# Altium schematic sheet main.SchDoc: =DocumentName
size A3; Scale: 1:1; DocumentType: Схема электрическая принципиальная; FirstReferrence: АБВГ.123456.001; CompanyName: "AS Manufacturing" LLC; Organization: "AS Manufacturing" LLC; Address1: 5 Sklyarenka St.; Address2: Kyiv 04073; Address3: Ukraine; Address4: https://ajax.systems/en/; SheetNumber: 1; SheetTotal: 8; Template_version: 1.0.1
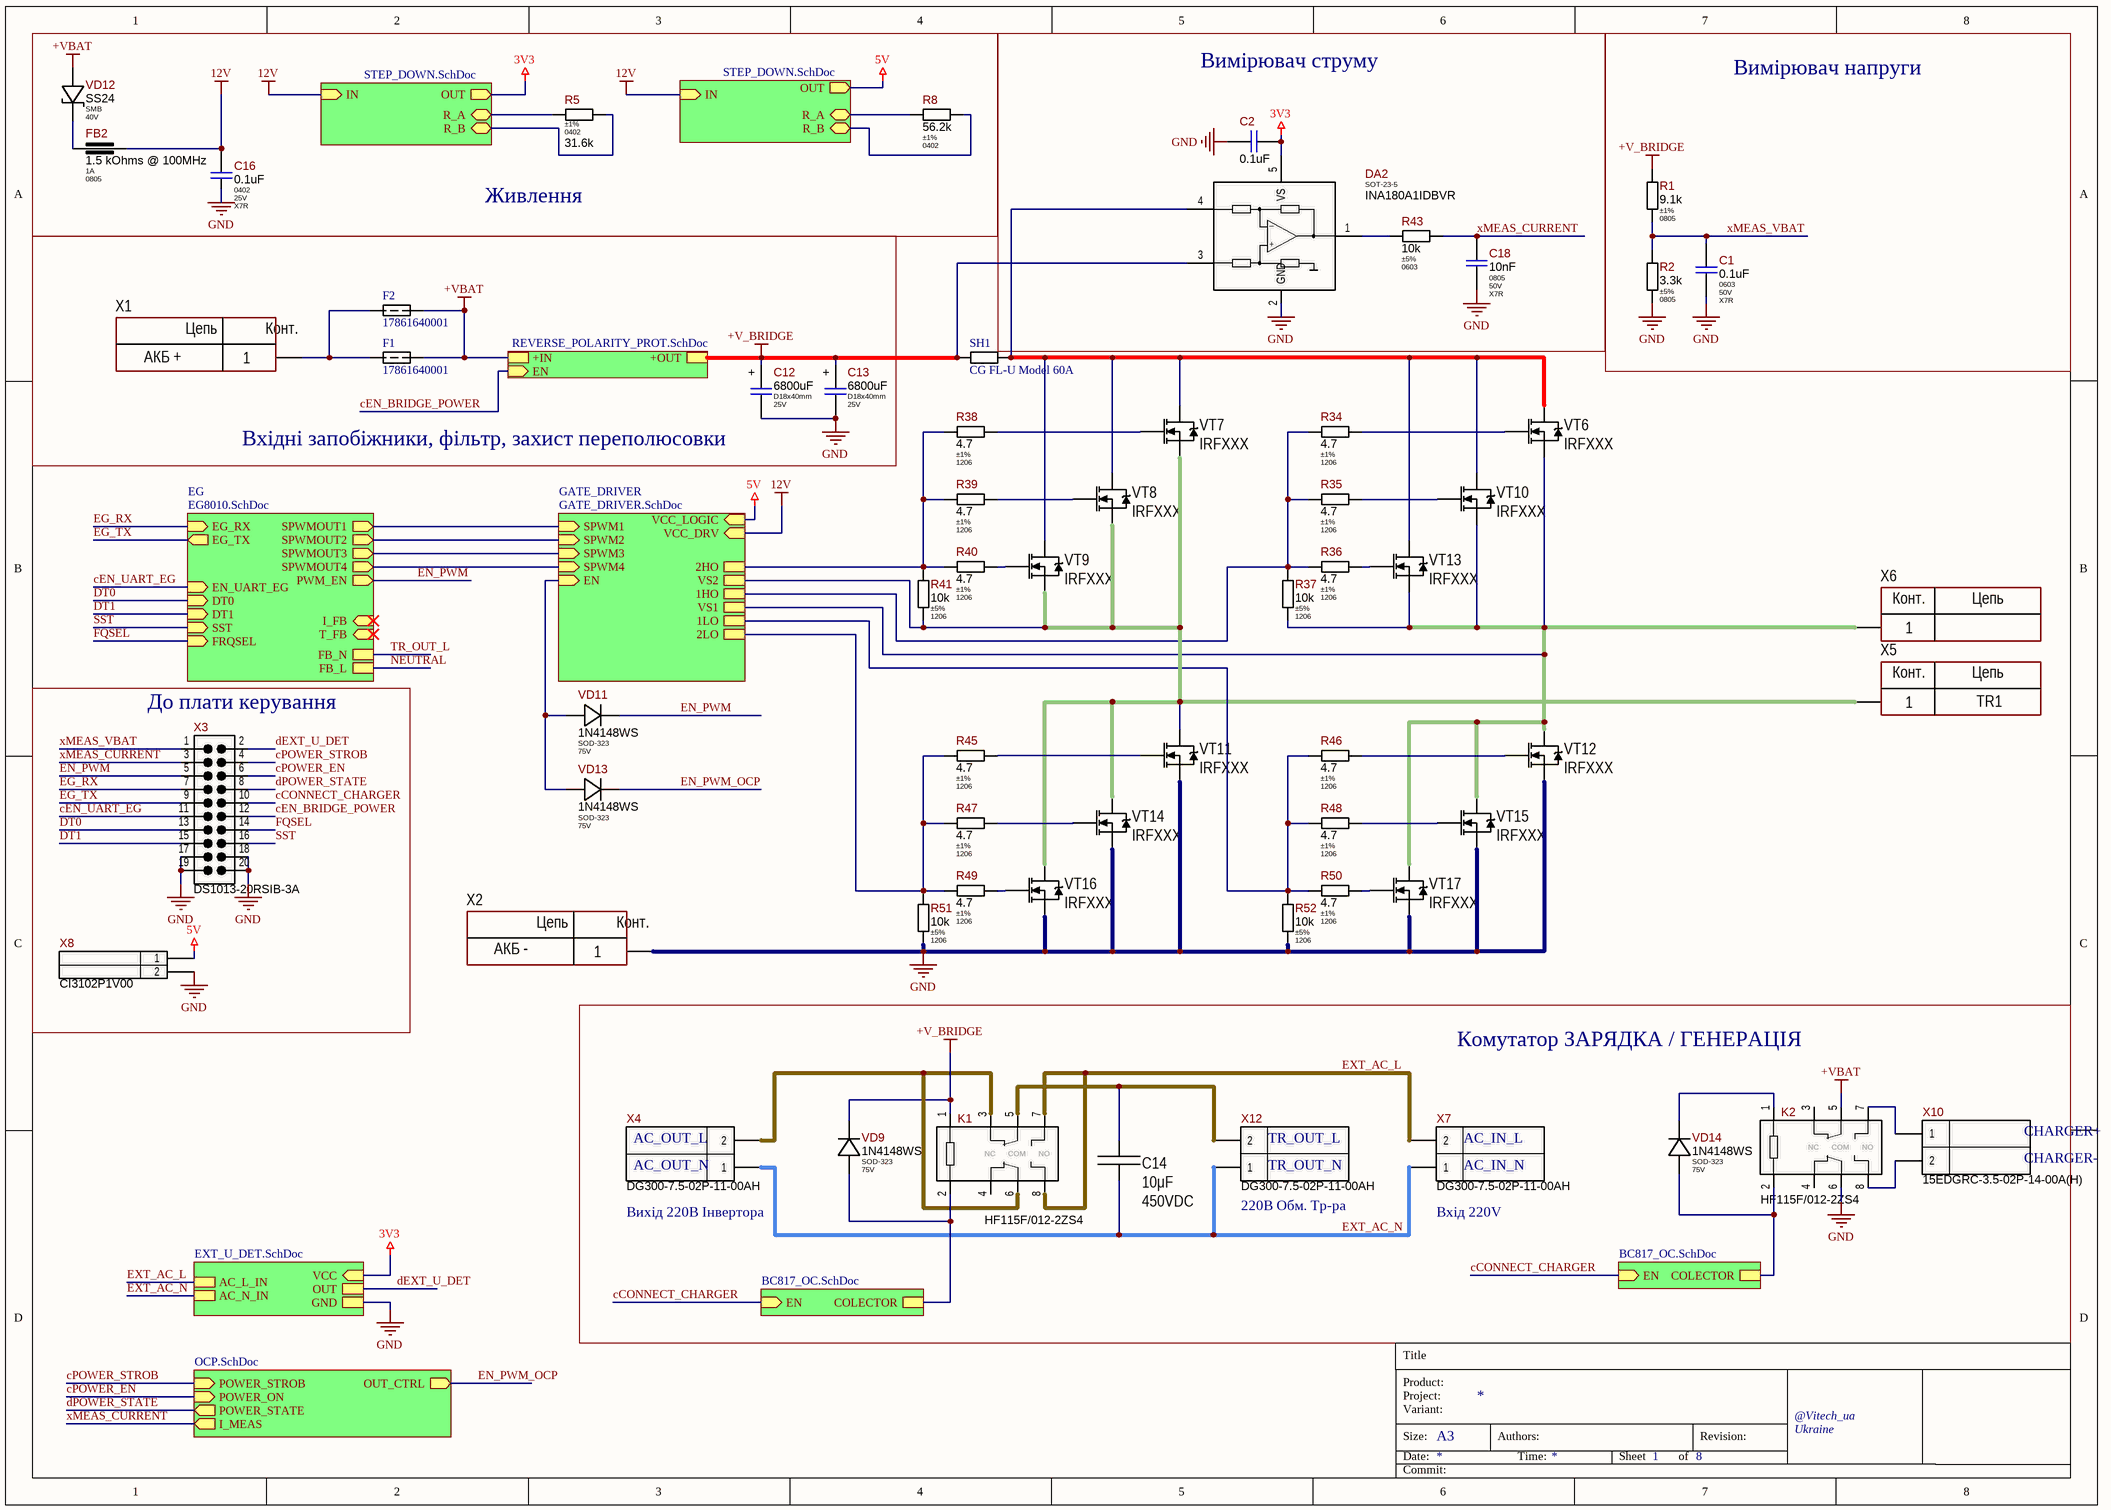
[diagram p0: main.SchDoc]

## Parts
C1  Package: 0603  Voltage: 50V  Dielectric Type: X7R  [C_CERAMIC_0603_MED]  (hidden comment: 0.1uF)
C2  0.1uF  [C_CERAMIC_0402_MED]
C12  value 6800uF  Package: D18x40mm  Voltage: 25V  [CAP-AE-PTH-180D05x400H20]  (hidden comment: 6800uFx25V)
C13  value 6800uF  Package: D18x40mm  Voltage: 25V  [CAP-AE-PTH-180D05x400H20]  (hidden comment: 6800uFx25V)
C14  value 10μF  Voltage: 450VDC  [CAP: B32922 (18x7x12.5mm)]
C16  Package: 0402  Voltage: 25V  Dielectric Type: X7R  [C_CERAMIC_0402_MED]  (hidden comment: 0.1uF)
C18  Package: 0805  Voltage: 50V  Dielectric Type: X7R  [CAP-0805(2012)X65T10]  (hidden comment: 10nF)
DA2  INA180A1IDBVR  [SOT-23-5]
F1  17861640001  [17861640001]
F2  17861640001  [17861640001]
FB2  value 1.5 kOhms @ 100MHz  Current: 1A  Package: 0805  [WE-CBF-0805-Series]  (hidden comment: 742792097)
K1  HF115F/012-2ZS4  [HF115Fxxx-1(2)Zx3(4)]
K2  HF115F/012-2ZS4  [HF115Fxxx-1(2)Zx3(4)]
R1  Tolerance: ±1%  Package: 0805  [R_ANY_CHIP_0805_MED]  (hidden comment: 9.1k)
R2  Tolerance: ±5%  Package: 0805  [R_ANY_CHIP_0805_MED]  (hidden comment: 3.3k)
R5  Tolerance: ±1%  Package: 0402  [R_ANY_CHIP_0402_MED]  (hidden comment: 31.6k)
R8  Tolerance: ±1%  Package: 0402  [R_ANY_CHIP_0402_MED]  (hidden comment: 56.2k)
R34  Tolerance: ±1%  Package: 1206  [R_ANY_CHIP_1206_MED]  (hidden comment: 4.7)
R35  Tolerance: ±1%  Package: 1206  [R_ANY_CHIP_1206_MED]  (hidden comment: 4.7)
R36  Tolerance: ±1%  Package: 1206  [R_ANY_CHIP_1206_MED]  (hidden comment: 4.7)
R37  Tolerance: ±5%  Package: 1206  [R_ANY_CHIP_1206_MED]  (hidden comment: 10k)
R38  Tolerance: ±1%  Package: 1206  [R_ANY_CHIP_1206_MED]  (hidden comment: 4.7)
R39  Tolerance: ±1%  Package: 1206  [R_ANY_CHIP_1206_MED]  (hidden comment: 4.7)
R40  Tolerance: ±1%  Package: 1206  [R_ANY_CHIP_1206_MED]  (hidden comment: 4.7)
R41  Tolerance: ±5%  Package: 1206  [R_ANY_CHIP_1206_MED]  (hidden comment: 10k)
R43  Tolerance: ±5%  Package: 0603  [R_ANY_CHIP_0603_MED]  (hidden comment: 10k)
R45  Tolerance: ±1%  Package: 1206  [R_ANY_CHIP_1206_MED]  (hidden comment: 4.7)
R46  Tolerance: ±1%  Package: 1206  [R_ANY_CHIP_1206_MED]  (hidden comment: 4.7)
R47  Tolerance: ±1%  Package: 1206  [R_ANY_CHIP_1206_MED]  (hidden comment: 4.7)
R48  Tolerance: ±1%  Package: 1206  [R_ANY_CHIP_1206_MED]  (hidden comment: 4.7)
R49  Tolerance: ±1%  Package: 1206  [R_ANY_CHIP_1206_MED]  (hidden comment: 4.7)
R50  Tolerance: ±1%  Package: 1206  [R_ANY_CHIP_1206_MED]  (hidden comment: 4.7)
R51  Tolerance: ±5%  Package: 1206  [R_ANY_CHIP_1206_MED]  (hidden comment: 10k)
R52  Tolerance: ±5%  Package: 1206  [R_ANY_CHIP_1206_MED]  (hidden comment: 10k)
SH1  CG FL-U Model 60A  [CG FL-U Model 60A]
VD9  Package: SOD-323  Voltage: 75V  [SOD-323_MED]  (hidden comment: 1N4148WS)
VD11  Package: SOD-323  Voltage: 75V  [SOD-323_MED]  (hidden comment: 1N4148WS)
VD12  Package: SMB  Voltage: 40V  [SMB_MED]  (hidden comment: SS24)
VD13  Package: SOD-323  Voltage: 75V  [SOD-323_MED]  (hidden comment: 1N4148WS)
VD14  Package: SOD-323  Voltage: 75V  [SOD-323_MED]  (hidden comment: 1N4148WS)
VT6  PartNumber: IRFXXX  [TO220(H)]
VT7  PartNumber: IRFXXX  [TO220(H)]
VT8  PartNumber: IRFXXX  [TO220(H)]
VT9  PartNumber: IRFXXX  [TO220(H)]
VT10  PartNumber: IRFXXX  [TO220(H)]
VT11  PartNumber: IRFXXX  [TO220(H)]
VT12  PartNumber: IRFXXX  [TO220(H)]
VT13  PartNumber: IRFXXX  [TO220(H)]
VT14  PartNumber: IRFXXX  [TO220(H)]
VT15  PartNumber: IRFXXX  [TO220(H)]
VT16  PartNumber: IRFXXX  [TO220(H)]
VT17  PartNumber: IRFXXX  [TO220(H)]
X1  CommentText: АКБ +  [CON: 8191]
X2  CommentText: АКБ -  [CON: 8191]
X3  DS1013-20RSIB-3A  [BH-20R]
X4  DG300-7.5-02P  [DG300-7.5-02P-11-00AH_REC]  (value not drawn)
X5  CommentText: TR1  [CON: 8191]
X6  (no value)  [CON: 8191]
X7  DG300-7.5-02P  [DG300-7.5-02P-11-00AH_REC]  (value not drawn)
X8  WH-02S  [WF-2S]  (value not drawn)
X10  15EDGRC-3.5-02P-14-00A(H)  [15EDGRC-3.5-2P-14-00]
X12  DG300-7.5-02P  [DG300-7.5-02P-11-00AH_REC]  (value not drawn)

## Blocks framed on the sheet
Живлення: C16 FB2 R5 R8 VD12
Вимірювач струму: C2 C18 DA2 R43
Вимірювач напруги: C1 R1 R2
Вхідні запобіжники, фільтр, захист переполюсовки: C12 C13 F1 F2 X1
До плати керування: X3 X8
Комутатор ЗАРЯДКА / ГЕНЕРАЦІЯ: C14 K1 K2 VD9 VD14 X4 X7 X10 X12

## Sub-sheets
EG = EG8010.SchDoc: T_FB (in), I_FB (in), PWM_EN (out), SPWMOUT1 (out), SPWMOUT2 (out), SPWMOUT3 (out), SPWMOUT4 (out), EG_RX (in), EG_TX (out), DT0 (in), DT1 (in), SST (in), FRQSEL (in), FB_N, FB_L, EN_UART_EG (in)
GATE_DRIVER = GATE_DRIVER.SchDoc: SPWM3 (in), SPWM4 (in), SPWM1 (in), SPWM2 (in), EN (in), VCC_DRV (in), 2HO, 2LO, 1HO, 1LO, VS2, VS1, VCC_LOGIC (in)
OC = BC817_OC.SchDoc: EN (in), COLECTOR
OC = BC817_OC.SchDoc: EN (in), COLECTOR
OCP = OCP.SchDoc: POWER_STROB (in), POWER_ON (in), POWER_STATE (out), OUT_CTRL (out), I_MEAS (out)
REVERSE_POL_PROT = REVERSE_POLARITY_PROT.SchDoc: +IN, +OUT, EN (in)
STEP_DOWN = STEP_DOWN.SchDoc: IN (in), OUT (out), R_A (bidir), R_B (bidir)
STEP_DOWN = STEP_DOWN.SchDoc: IN (in), OUT (out), R_A (bidir), R_B (bidir)
U_DET = EXT_U_DET.SchDoc: AC_L_IN, AC_N_IN, VCC (in), OUT, GND

## Nets
3V3: C2.1 DA2.5(VS) ; sheet STEP_DOWN/OUT, sheet U_DET/VCC
5V: X8.1 ; sheet STEP_DOWN/OUT, sheet GATE_DRIVER/VCC_LOGIC
12V: C16.2 FB2.1 ; sheet STEP_DOWN/IN, sheet STEP_DOWN/IN, sheet GATE_DRIVER/VCC_DRV
+V_BRIDGE: C12.1 C13.1 DA2.3(IN+) K1.1(COIL1) R1.1 SH1.1 VD9.CA ; sheet REVERSE_POL_PROT/+OUT
+VBAT: F1.1 F2.1 K2.5(1-COM) VD12.AN ; sheet REVERSE_POL_PROT/+IN
GND: C1.2 C2.2 C12.2 C13.2 C16.1 C18.2 DA2.2(GND) K2.6(2-COM) R2.2 R51.1 R52.1 VT11.3(S) VT12.3(S) VT14.3(S) VT15.3(S) VT16.3(S) VT17.3(S) X2.1 X3.17 X3.18 X3.19 X3.20 X8.2 ; sheet U_DET/GND
cCONNECT_CHARGER: X3.10 ; sheet OC/EN, sheet OC/EN
cEN_BRIDGE_POWER: X3.12 ; sheet REVERSE_POL_PROT/EN
cEN_UART_EG: X3.11 ; sheet EG/EN_UART_EG
cPOWER_EN: X3.6 ; sheet OCP/POWER_ON
cPOWER_STROB: X3.4 ; sheet OCP/POWER_STROB
dEXT_U_DET: X3.2 ; sheet U_DET/OUT
dPOWER_STATE: X3.8 ; sheet OCP/POWER_STATE
DT0: X3.13 ; sheet EG/DT0
DT1: X3.15 ; sheet EG/DT1
EG_RX: X3.7 ; sheet EG/EG_RX
EG_TX: X3.9 ; sheet EG/EG_TX
EN_PWM: VD11.CA X3.5 ; sheet EG/PWM_EN
EN_PWM_OCP: VD13.CA ; sheet OCP/OUT_CTRL
EXT_AC_L: K1.7(2-NO) K1.8(2-NO) X7.2 ; sheet U_DET/AC_L_IN
EXT_AC_N: X4.1 X7.1 X12.1 ; sheet U_DET/AC_N_IN
FQSEL: X3.14 ; sheet EG/FRQSEL
NEUTRAL: sheet EG/FB_L
SST: X3.16 ; sheet EG/SST
TR_OUT_L: sheet EG/FB_N
xMEAS_CURRENT: C18.1 R43.2 X3.3 ; sheet OCP/I_MEAS
xMEAS_VBAT: C1.1 R1.2 R2.1 X3.1
NetC14_1: C14.1 K1.5(1-COM) X12.2
NetDA2_1: DA2.1(OUT) R43.1
NetDA2_4: DA2.4(IN-) SH1.2 VT6.2(D) VT7.2(D) VT8.2(D) VT9.2(D) VT10.2(D) VT13.2(D)
NetF1_2: F1.2 F2.2 X1.1
NetFB2_2: FB2.2 VD12.CA
NetK1_2: K1.2(COIL2) VD9.AN ; sheet OC/COLECTOR
NetK1_3: K1.3(1-NC) K1.6(2-COM) X4.2
NetK2_1: K2.1(COIL1) VD14.CA
NetK2_2: K2.2(COIL2) VD14.AN ; sheet OC/COLECTOR
NetK2_7: K2.7(2-NO) X10.1
NetK2_8: K2.8(2-NO) X10.2
NetR5_1: R5.1 ; sheet STEP_DOWN/R_A
NetR5_2: R5.2 ; sheet STEP_DOWN/R_B
NetR8_1: R8.1 ; sheet STEP_DOWN/R_A
NetR8_2: R8.2 ; sheet STEP_DOWN/R_B
NetR34_1: R34.1 R35.1 R36.1 R37.2 ; sheet GATE_DRIVER/1HO
NetR34_2: R34.2 VT6.1(G)
NetR35_2: R35.2 VT10.1(G)
NetR36_2: R36.2 VT13.1(G)
NetR37_1: R37.1 VT6.3(S) VT10.3(S) VT12.2(D) VT13.3(S) VT15.2(D) VT17.2(D) X6.1 ; sheet GATE_DRIVER/VS1
NetR38_1: R38.1 R39.1 R40.1 R41.2 ; sheet GATE_DRIVER/2HO
NetR38_2: R38.2 VT7.1(G)
NetR39_2: R39.2 VT8.1(G)
NetR40_2: R40.2 VT9.1(G)
NetR41_1: R41.1 VT7.3(S) VT8.3(S) VT9.3(S) VT11.2(D) VT14.2(D) VT16.2(D) X5.1 ; sheet GATE_DRIVER/VS2
NetR45_1: R45.1 R47.1 R49.1 R51.2 ; sheet GATE_DRIVER/2LO
NetR45_2: R45.2 VT11.1(G)
NetR46_1: R46.1 R48.1 R50.1 R52.2 ; sheet GATE_DRIVER/1LO
NetR46_2: R46.2 VT12.1(G)
NetR47_2: R47.2 VT14.1(G)
NetR48_2: R48.2 VT15.1(G)
NetR49_2: R49.2 VT16.1(G)
NetR50_2: R50.2 VT17.1(G)
NetVD11_AN: VD11.AN VD13.AN ; sheet GATE_DRIVER/EN
(unnamed): sheet EG/SPWMOUT1, sheet GATE_DRIVER/SPWM1
(unnamed): sheet EG/SPWMOUT2, sheet GATE_DRIVER/SPWM2
(unnamed): sheet EG/SPWMOUT3, sheet GATE_DRIVER/SPWM3
(unnamed): sheet EG/SPWMOUT4, sheet GATE_DRIVER/SPWM4

Not connected (* = marked no-connect by the designer): C14 2; K1 4(2-NC); K2 3(1-NC) 4(2-NC)

## Notes on the sheet
- (near X4) AC_OUT_L
- (near X4) AC_OUT_N
- (near X12) TR_OUT_L
- (near X12) TR_OUT_N
- (near X7) AC_IN_L
- (near X7) AC_IN_N
- (near X10) CHARGER-
- (near X10) CHARGER+
- (near X4) Вихід 220В Інвертора
- (near X12) 220В Обм. Тр-ра
- (near X7) Вхід 220V
- Title
- Product:
- Project:
- Size:
- Date:
- Variant:
- A3
- Authors:
- Time:
- Sheet
- of
- Revision:
- @Vitech_ua
- Commit:
- (in symbol B41858C5688M000) +
- (in symbol Connector_single_power) Цепь; Конт.
- (in symbol HF115F/012-2ZS4) NC; COM; NO
- (in symbol INA180A1IDBVR) _; +

## Library data of the parts
C1 = CL10B104KB8NNND: 100nF 50V X7R ±10% 0603 Ceramic Capacitor RoHS; Manufacturer: Samsung Electro-Mechanics; Ajax_1C_ID: 21313; Ajax_1C_PN: 100nF 50V X7R 10% 0603 CL10B104KB8NNND ceramic capacitor SMD; Ajax_1С_Status: Substitution; Standard Lead Time: 18 Weeks; Component Status: Released; Replacement: CL10B104KB8NNNC; GUID_1C: f1fd6399-ca68-11ea-ab63-0050569f2651; Value: 0.1uF; Part Number: CL10B104KB8NNND; Part Type: Ceramic / X7R / 0603; Component Type: SMD; Temperature Range: -55°C ~ 125°C; Tolerance: ±10%; ComponentLink1URL: https://media.digikey.com/pdf/Data%20Sheets/Samsung%20PDFs/CL_Series_MLCC_ds.pdf; Supplier 1: Digi-Key; Supplier Part Number 1: CL10B104KB8NNND-ND; Price: 0,0039378; ComponentLink1Description: Datasheet
C2 C16 = GRM155R71E104KE14J: 100nF 25V X7R ±10% 0402 Ceramic Capacitor RoHS; Manufacturer: Murata Electronics; Ajax_1C_ID: 24481; Ajax_1C_PN: 100nF 25V X7R 10% 0402 GRM155R71E104KE14J Ceramic Capacitor SMD RoHS; Ajax_1С_Status: Mass Production; Standard Lead Time: 24 Weeks; Component Status: Released; Replacement: NONE; Value: 0.1uF; Part Number: GRM155R71E104KE14J; Part Type: Ceramic / X7R / 0402; Component Type: SMD; Temperature Range: -55°C ~ 125°C; Tolerance: ±10%; ComponentLink1URL: https://eu.mouser.com/datasheet/2/281/1/GRM155R71E104KE14_01A-1984358.pdf; ComponentLink1Description: Datasheet
  C2: Package: 0402; Voltage: 25V; Dielectric Type: X7R
C12 C13 = B41858C5688M000: 6800uF 25V ±20% Aluminum Electrolytic Capacitors Radial, 5000 Hrs @ 105°C, 4467mA Ripple Current; Manufacturer: Epcos / TDK; Ajax_1C_PN: NONE; Ajax_1С_Status: RND Only; Standard Lead Time: 36 Weeks; Component Status: Released; Part Number: B41858C5688M000; Part Type: Aluminum; Component Type: PTH; Temperature Range: -55°C ~ 105°C; Tolerance: ±20%; Dielectric Type: NONE; ComponentLink1URL: https://product.tdk.com/system/files/dam/doc/product/capacitor/aluminum-electrolytic/single-ended/data_sheet/20/30/db/aec/b41858.pdf; Supplier 1: Mouser; Supplier Part Number 1: 871-B41858C5688M; Replacement: NONE; Price: NONE; ComponentLink1Description: Datasheet
C14 = Film: Manufacturer: Epcos; PartNumber: B32774D4106K000; ValueManufacturerPartNumber: Film capacitor, 10μF, 450VDC, ±10%, 10.9mOhm, 31.5x15 mm, -40...+105°C; TypeCapacitor: Film capacitor; Tolerance: ±10%; Impedance: 10.9mOhm; Package: 31.5x15 mm; HelpURL: https://www.digikey.com/products/en/capacitors/film-capacitors/62?k=&pkeyword=&sv=0&pv2097=1958&sf=0&FV=fffc01ef%2C1f140000%2Cffe0003e%2Cffec6366&quantity=1&ColumnSort=1000011&page=1&stock=1&pageSize=25; Temperature: -40...+105°C
C18 = CL21B103KBANNNC: 10nF 50V X7R ±10% 0805 Ceramic Capacitor RoHS; Manufacturer: Samsung Electro-Mechanics; Ajax_1C_PN: NONE; Ajax_1С_Status: RND Only; Standard Lead Time: 26 Weeks; Component Status: Released; Value: 10nF; Part Number: CL21B103KBANNNC; Part Type: Ceramic / X7R / 0805; Component Type: SMD; Temperature Range: -55°C ~ 125°C; Tolerance: ±10%; ComponentLink1URL: https://eu.mouser.com/datasheet/2/585/MLCC-1837944.pdf; Supplier 1: Mouser; Supplier Part Number 1: 187-CL21B103KBANNNC; Replacement: NONE; Price: NONE; ComponentLink1Description: Datasheet
DA2 = INA180A1IDBVR: Low- and High-Side Voltage Output, 2.7V to 5.5V, Current-Sense Amplifiers, Gain 20 V/V, SOT-23-5; Manufacturer: Texas Instruments; Ajax_1C_ID: 25363; Ajax_1C_PN: INA180A1IDBVT TI Current Sense Amplifier, SOT-23-5; Ajax_1С_Status: RND Only; Standard Lead Time: 12 Weeks; Component Status: Released; Replacement: NONE; GUID_1C: 575c0dc1-4f39-11eb-ab6e-0050569f2651; Package: SOT-23-5; Part Number: INA180A1IDBVR; Part Type: Amplifier / Current Sense; Component Type: SMD; Temperature Range: -40°C ~ 125°C; ComponentLink1URL: https://www.ti.com/lit/ds/symlink/ina180.pdf; Supplier 1: Digi-Key; Supplier Part Number 1: 296-47652-2-ND; Price: 0,367; ComponentLink1Description: Datasheet
F1 F2 = 17861640001: Fuse; Manufacturer_Name: LITTELFUSE; Datasheet Link: https://www.littelfuse.com/media?resourcetype=2d-prints&itemid=dcb90cf3-0771-4ccd-8726-26101cf00574&filename=ol-178.6164.0000(c); Height: 17.5mm; Manufacturer_Part_Number: 17861640001
FB2 = 742792097: 1.5 kOhms @ 100MHz Power Line Ferrite Bead 0805, 1A 300mOhm; Manufacturer: Wurth Elektronik; Ajax_1C_ID: 84781; Ajax_1C_PN: 1.5k 1A 0805 742792097 Chip Ferrite Bead; Ajax_1С_Status: RND Only; Saturation Current: NONE; Tolerance: ±25%; Component Status: On Review; Standard Lead Time: 12 Weeks; GUID_1C: 3c69ea00-725e-11ee-a921-00505699469b; Part Number: 742792097; Part Type: Ferrite Bead; Component Type: SMD; Temperature Range: -55°C ~ 125°C; ComponentLink1URL: https://www.we-online.com/components/products/datasheet/742792097.pdf; Supplier 1: Digi-Key; Supplier Part Number 1: 732-4649-2-ND; Replacement: NONE; Price: 0,178; ComponentLink1Description: Datasheet
K1 K2 = HF115F/012-2ZS4: Miniature High Power Relay, DPDT (2 Form C), 12VDC 400mW Coil, 5.0mm 2 Pole 8A AgCdO; Manufacturer: Hongfa; Ajax_1C_ID: 38428; Ajax_1C_PN: HF115F/012-2ZS4 HONGFA, Реле; Ajax_1С_Status: RND Only; Component Status: Released; Replacement: NONE; GUID_1C: 4ba44618-64be-11ec-a90c-00505699469b; Part Number: HF115F/012-2ZS4; Part Type: Relay; Component Type: PTH; Temperature Range: -40°C ~ 85°C; ComponentLink1URL: https://www.tme.eu/Document/2962d862af219292e2e76bbc4b5ef3a2/hf115f.pdf; Supplier 1: TME; Supplier Part Number 1: HF115F/012-2ZS4; Price: 2,02140634; ComponentLink1Description: Datasheet
R1 = RC0805FR-079K1L: 9.1 kOhms ±1%, 1/8W 0805 Thick Film Resistor; Manufacturer: Yageo; Ajax_1C_ID: 9033; Ajax_1C_PN: 9.1k 1% 0805 Resistors SMD RoHS; Ajax_1С_Status: RND Only; Power Rating: 0.125W; Voltage: 150V; Component Status: Released; Temperature Stability: ±100ppm/°C; Replacement: NONE; GUID_1C: 9c2a4261-9b4a-11e6-8242-d8cb8a9acc66; Value: 9.1k; Part Number: RC0805FR-079K1L; Component Type: SMD; Part Type: Thick Film; Temperature Range: -55°C ~ 155°C; ComponentLink1URL: https://eu.mouser.com/datasheet/2/447/PYu_RC_Group_51_RoHS_L_10-1664068.pdf; Supplier 1: Digi-Key; Supplier Part Number 1: 311-9.10KCRTR-ND; Price: 0,00168; ComponentLink1Description: Datasheet
R2 = RC0805JR-073K3L: 3.3 kOhms ±5%, 1/8W 0805 Thick Film Resistor; Manufacturer: Yageo; Ajax_1C_ID: 9030; Ajax_1C_PN: 3.3k 5% 0805 Resistors SMD RoHS; Ajax_1С_Status: RND Only; Power Rating: 0.125W; Voltage: 150V; Component Status: Released; Temperature Stability: ±100ppm/°C; Replacement: NONE; GUID_1C: cb9785ec-9b47-11e6-8242-d8cb8a9acc66; Value: 3.3k; Part Number: RC0805JR-073K3L; Component Type: SMD; Part Type: Thick Film; Temperature Range: -55°C ~ 155°C; ComponentLink1URL: https://eu.mouser.com/datasheet/2/447/PYu_RC_Group_51_RoHS_L_10-1664068.pdf; Price: 0,001081; ComponentLink1Description: Datasheet
R5 = RC0402FR-0731K6L: 31.6 kOhms ±1% 1/16W 0402 Thick Film Resistor; Manufacturer: Yageo; Ajax_1C_ID: 42440; Ajax_1C_PN: 31.6k 1% 0402 Resistors SMD RoHS; Ajax_1С_Status: RND Only; Power Rating: 0.062W; Voltage: 50V; Component Status: Released; Temperature Stability: ±100ppm/°C; Replacement: NONE; Value: 31.6k; Part Number: RC0402FR-0731K6L; Component Type: SMD; Temperature Range: -55°C ~ 155°C; ComponentLink1URL: https://eu.mouser.com/datasheet/2/447/PYu_RC_Group_51_RoHS_L_11-1984063.pdf; Supplier 1: Mouser; Supplier Part Number 1: 603-RC0402FR-0731K6L; ComponentLink1Description: Datasheet; Part Type: Thick Film
R8 = RC0402FR-0756K2L: 56.2 kOhms ±1% 1/16W 0402 Thick Film Resistor; Manufacturer: Yageo; Ajax_1C_ID: 20241; Ajax_1C_PN: 56.2k 1% 0402 Resistors SMD RoHS; Ajax_1С_Status: Mass Production; Power Rating: 0.062W; Voltage: 50V; Component Status: Released; Temperature Stability: ±100ppm/°C; Replacement: NONE; GUID_1C: 73881b35-8945-11ea-ab60-0050569f2651; Value: 56.2k; Part Number: RC0402FR-0756K2L; Component Type: SMD; Part Type: Thick Film; Temperature Range: -55°C ~ 155°C; ComponentLink1URL: https://eu.mouser.com/datasheet/2/447/PYu_RC_Group_51_RoHS_L_11-1984063.pdf; Supplier 1: Digi-Key; Supplier Part Number 1: YAG3187TR-ND; Price: 0,00065; ComponentLink1Description: Datasheet
R34-R36 R38-R40 R45-R50 = RC1206FR-074R7L: 4.7 Ohms ±1%, 1/4W 1206 Thick Film Resistor; Manufacturer: Yageo; Ajax_1C_ID: 32212; Ajax_1C_PN: 4.7R 1% 1206 0.25W Resistors SMD RoHS; Ajax_1С_Status: Mass Production; Power Rating: 0.25W; Voltage: 200V; Component Status: Released; Temperature Stability: ±200ppm/°C; Replacement: NONE; GUID_1C: de4b8aaa-eaef-11eb-ab74-0050569f2651; Value: 4.7; Part Number: RC1206FR-074R7L; Component Type: SMD; Part Type: Thick Film; Temperature Range: -55°C ~ 155°C; ComponentLink1URL: https://eu.mouser.com/datasheet/2/447/PYu_RC_Group_51_RoHS_L_11-1984063.pdf; Supplier 1: Digi-Key; Supplier Part Number 1: 311-4.70FRTR-ND; Price: 0,0021; ComponentLink1Description: Datasheet
R37 R41 R51 R52 = RC1206JR-0710KL: 10 kOhms ±5% 1/4W 1206 Thick Film Resistor; Manufacturer: Yageo; Ajax_1C_ID: 29423; Ajax_1C_PN: 10k 5% 1206 Resistors SMD RoHS; Ajax_1С_Status: RND Only; Power Rating: 0.25W; Voltage: 200V; Component Status: Released; Temperature Stability: ±100ppm/°C; Replacement: NONE; GUID_1C: e3e7c694-a8f0-11eb-ab74-0050569f2651; Value: 10k; Part Number: RC1206JR-0710KL; Component Type: SMD; Part Type: Thick Film; Temperature Range: -55°C ~ 155°C; ComponentLink1URL: https://eu.mouser.com/datasheet/2/447/PYu_RC_Group_51_RoHS_L_11-1984063.pdf; Supplier 1: Digi-Key; Supplier Part Number 1: 311-10KERTR-ND; Price: 0,0018; ComponentLink1Description: Datasheet
R43 = RC0603JR-0710KL: 10 kOhms ±5%, 1/10W 0603 Thick Film Resistor; Manufacturer: Yageo; Ajax_1C_ID: 2860; Ajax_1C_PN: 10k 5% 0603 Resistors SMD RoHS; Ajax_1С_Status: Mass Production; Power Rating: 0.1W; Voltage: 75V; Component Status: Released; Temperature Stability: ±100ppm/°C; Replacement: NONE; GUID_1C: df4c2852-e567-11e2-9779-6c626deda1bb; Value: 10k; Part Number: RC0603JR-0710KL; Component Type: SMD; Part Type: Thick Film; Temperature Range: -55°C ~ 155°C; ComponentLink1URL: https://eu.mouser.com/datasheet/2/447/PYu_RC_Group_51_RoHS_L_10-1664068.pdf; Supplier 1: Digi-Key; Supplier Part Number 1: 311-10KGRTR-ND; Price: 0,0006; ComponentLink1Description: Datasheet
VD9 VD11 VD13 VD14 = 1N4148WS: Diode Standard 75V 150mA, SOD-323F; Manufacturer: Diodec Semiconductor; Ajax_1C_ID: 10255; Ajax_1C_PN: 1N4148WS diotec SOD-323; Ajax_1С_Status: Mass Production; Marking: W2; Component Status: Released; Standard Lead Time: NONE; Vf: 1V @ 50mA; Replacement: 1N4148WS-E; GUID_1C: 3d8ac204-519f-11e7-8106-14dda9d2d04d; Part Type: Fast Switching; Component Type: SMD; Current: 150mA; Temperature Range: -55°C ~ 150°C; ComponentLink1URL: https://diotec.com/tl_files/diotec/files/pdf/datasheets/1n4148ws.pdf; Supplier 1: TME; Supplier Part Number 1: 1N4148WS-DIO; Price: 0,00864; ComponentLink1Description: Datasheet; Part Number: 1N4148WS
VD12 = SS24: Diode Schottky 40V 2A, SMB; Manufacturer: Vishay Semiconductor; Ajax_1C_ID: 1327; Ajax_1C_PN: SK24/SK26/SS24/SS26, диод; Ajax_1С_Status: Mass Production; Component Status: Released; Standard Lead Time: 11 Weeks; Vf: 500mV @ 2A; Replacement: NONE; GUID_1C: ee69b8b3-dd45-11e0-af93-6c626deda1bb; Part Number: SS24; Part Type: Schottky; Component Type: SMD; Marking: SS24; Current: 2A; Temperature Range: -65°C ~ 125°C; ComponentLink1URL: https://www.vishay.com/docs/88748/ss22.pdf; Supplier 1: Digi-Key; Supplier Part Number 1: SS24-E3/52TGITR-ND; Price: 0,038895; ComponentLink1Description: Datasheet
VT6-VT17 = MOSFET_N_123: Manufacturer: Infineon Technologies; ValueManufacturerPartNumber: MOSFET N-channel transistor, 80V, 7A, 9.1nC, 2.5W, 34mOhm, 756pF, 8-TDSON, -55...+150°C; TypeTransistor: MOSFET N-channel transistor; VoltageDS: 80V; CurrentDS: 7A; RDS: 34mOhm; GateCharge: 9.1nC; InputCapacitor: 756pF; MaxPower: 2.5W; Package: 8-TDSON; HelpURL: https://www.digikey.com/product-detail/en/infineon-technologies/BSC340N08NS3GATMA1/BSC340N08NS3GATMA1TR-ND/2080655; Temperature: -55...+150°C
X1 X2 X5 X6 = Connector_single_power: ValueManufacturerPartNumber: Power connector, *, *; TypeConnector: Power connector; Manufacturer: *; HelpURL: *; PartNumber: *; VoltageMax: *; CurrentMax: *
X3 = DS1013-20RSIB-3A: 2.54mm Right Angle Box Header, Two Rows, 20 Pin, 20mOhm max, Male IDC BH-20R; Manufacturer: Connfly; Ajax_1C_ID: 8560; Ajax_1C_PN: BH-20R : Вилка в плату IDC угловая : IDC-20MR; Ajax_1С_Status: Mass Production; Component Status: Released; Replacement: NONE; GUID_1C: 731205be-314d-11e6-81b9-d8cb8a9acc66; Part Number: DS1013-20RSIB-3A; Part Type: IDC (Box Header) / Right Angle; Component Type: PTH; Temperature Range: -40°C ~ 105°C; ComponentLink1URL: \\altiumdb.ajax.local\files\Datasheet\Connectors\DS1013.pdf; Price: 0,1; ComponentLink1Description: Datasheet
X4 X7 X12 = DG300-7.5-02P-11-00AH: Screw Terminal, 7.5mm Pitch, 2 pin, Grey; Manufacturer: Degson; Ajax_1C_ID: 14664; Ajax_1С_Status: RND Only; Component Status: Released; Replacement: NONE; GUID_1C: 80a5b435-17ec-11e9-ab4d-0050569f1984; Part Number: DG300-7.5-02P-11-00AH; Ajax_1C_PN: DG300-7.5-02P-11-00AH; Part Type: Terminal; Component Type: PTH; Temperature Range: -30°C ~ 120°C; ComponentLink1URL: https://www.tme.eu/Document/adcdc895102d44b158b752608cb08ff1/DG300-5.0.pdf; Supplier 1: TME; Supplier Part Number 1: DG300-7.5-2P11; Price: 0,108; ComponentLink1Description: Datasheet
X8 = CI3102P1V00: WH Series 2.54mm Wire to Board Straight DIP Type Headers, 2 Pin; Manufacturer: CviLux; Ajax_1C_ID: 6817; Ajax_1C_PN: WF-02S (DS1070-2M) Штекер "папа"; 2 контакта; шаг 2.54мм; прямой; на плату; Ajax_1С_Status: RND Only; Component Status: Released; Replacement: NONE; GUID_1C: 74812bc3-35d6-11e5-ad28-a45d36c4a9e5; Part Number: CI3102P1V00; Part Type: Wire-to-Board / Header; Component Type: PTH; Temperature Range: -25℃ ~ 85℃; ComponentLink1URL: \\altiumdb.ajax.local\files\Datasheet\Connectors\CI3102S.pdf; Price: 0,016; ComponentLink1Description: Datasheet
X10 = 15EDGRC-3.5-02P-14-00A(H): Pluggable Terminal Block, 3.5mm Pitch, 2 Pin, Right Angle, 7A/250V, Green; Manufacturer: Degson; Ajax_1C_ID: 36870; Ajax_1C_PN: 15EDGRC-3.5-02P-14-00A[H] , клеммник; Ajax_1С_Status: RND Only; Component Status: Released; Replacement: NONE; GUID_1C: aa44d4a6-4dc7-11ec-a356-005056994834; Part Number: 15EDGRC-3.5-02P-14-00A(H); Part Type: Terminal / Pluggable; Component Type: PTH; Temperature Range: -40°C ~ 105°C; ComponentLink1URL: \\altiumdb.ajax.local\files\Datasheet\Connectors\15EDGRC-3.5-XXP-1Y-00A(H).pdf; Supplier 1: TME; Supplier Part Number 1: 15EDGRC-3.5/2P; Price: 0,10172662; ComponentLink1Description: Datasheet
SH1 = CG FL-U Model 60A: link: http://www.cnchog.com/products/40a-220a-ID167.html